# Altium schematic sheet 256Kx16_SRAM.SchDoc: 256Kx16 SRAM
size A4; Organization: Altium Limited.
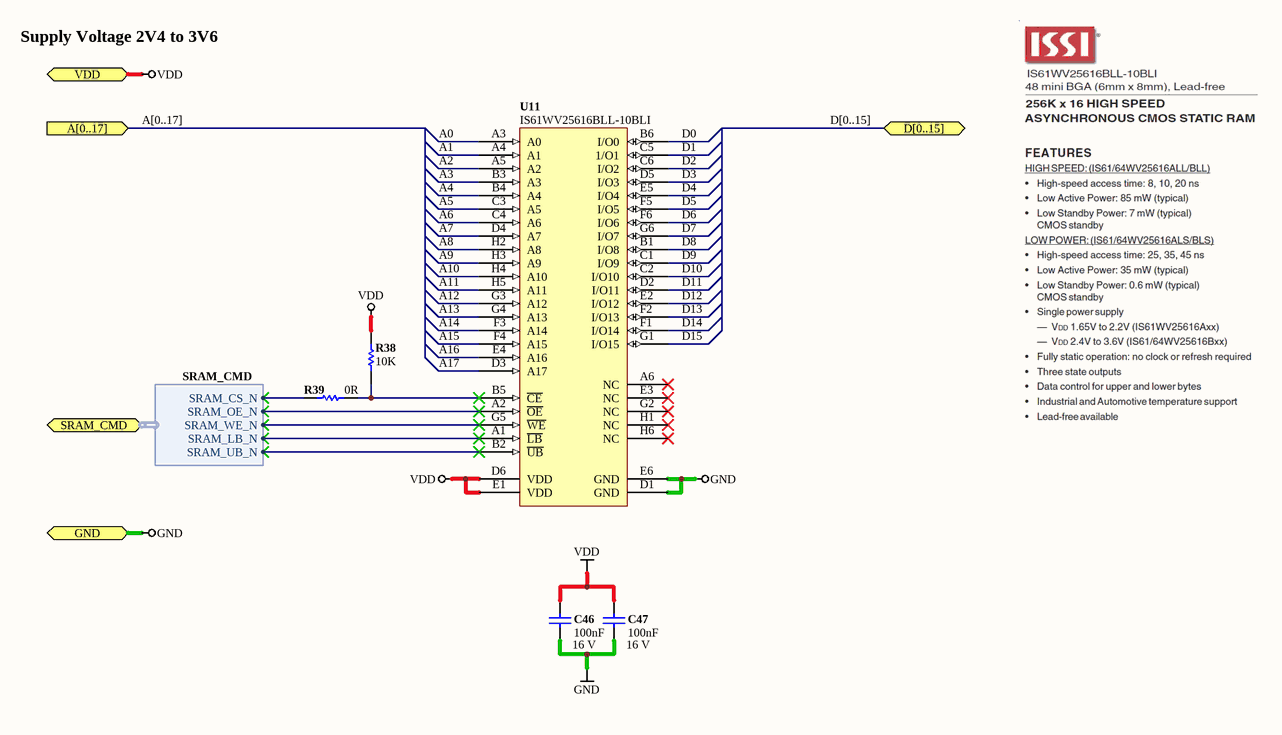
[diagram p0: 256Kx16_SRAM.SchDoc]

## Parts
C46  value 100nF  Rated Voltage: 16 V  [CAPC0402(1005)60_N]  (hidden comment: CAP 100nF 16V 0402(1005))
C47  value 100nF  Rated Voltage: 16 V  [CAPC0402(1005)60_N]  (hidden comment: CAP 100nF 16V 0402(1005))
R38  value 10K  [RESC0402(1005)_N]  (hidden comment: 10K 1% 0402(1005))
R39  value 0R  [RESC0402(1005)_N]  (hidden comment: Jumper 0402(1005))
U11  IS61WV25616BLL-10BLI  [ISSI-48L-TFBGA]

## Ports
A[0..17] (in), D[0..15] (bidir), GND, SRAM_CMD (harness SRAM_CMD), VDD

## Harnesses
SRAM_CMD: SRAM_OE_N, SRAM_WE_N, SRAM_LB_N, SRAM_UB_N, SRAM_CS_N

## Nets
GND: C46.1 C47.1 U11.D1(GND) U11.E6(GND) ; port GND
VDD: C46.2 C47.2 R38.2 U11.D6(VDD) U11.E1(VDD) ; port VDD
A0: U11.A3(A0)
A1: U11.A4(A1)
A2: U11.A5(A2)
A3: U11.B3(A3)
A4: U11.B4(A4)
A5: U11.C3(A5)
A6: U11.C4(A6)
A7: U11.D4(A7)
A8: U11.H2(A8)
A9: U11.H3(A9)
A10: U11.H4(A10)
A11: U11.H5(A11)
A12: U11.G3(A12)
A13: U11.G4(A13)
A14: U11.F3(A14)
A15: U11.F4(A15)
A16: U11.E4(A16)
A17: U11.D3(A17)
D0: U11.B6(I/O0)
D1: U11.C5(1/O1)
D2: U11.C6(I/O2)
D3: U11.D5(I/O3)
D4: U11.E5(I/O4)
D5: U11.F5(I/O5)
D6: U11.F6(I/O6)
D7: U11.G6(I/O7)
D8: U11.B1(I/O8)
D9: U11.C1(I/O9)
D10: U11.C2(I/O10)
D11: U11.D2(I/O11)
D12: U11.E2(I/O12)
D13: U11.F2(I/O13)
D14: U11.F1(I/O14)
D15: U11.G1(I/O15)
NetR38_1: R38.1 R39.2 U11.B5(~{CE})
NetR39_1: R39.1 ; port SRAM_CMD.SRAM_CS_N
NetU11_A1: U11.A1(~{LB}) ; port SRAM_CMD.SRAM_LB_N
NetU11_A2: U11.A2(~{OE}) ; port SRAM_CMD.SRAM_OE_N
NetU11_B2: U11.B2(~{UB}) ; port SRAM_CMD.SRAM_UB_N
NetU11_G5: U11.G5(~{WE}) ; port SRAM_CMD.SRAM_WE_N

Not connected (* = marked no-connect by the designer): U11 A6(NC)* E3(NC)* G2(NC)* H1(NC)* H6(NC)*

## Buses and harness runs
bus A[0..17] = port A[0..17]
bus D[0..15] = port D[0..15]

## Notes on the sheet
- Supply Voltage 2V4 to 3V6
- Sheet Title
- Project Title
- Size:
- Date:
- A4
- Item:
- Time:
- Revision:
- Sheet
- of
- File:

## Library data of the parts
C46 C47 = CMP-1034-02069-1: CAP 100nF 16V ±10% 0402 (1005 Metric) Thickness 0.6mm SMD; Case-EIA: 0402; Case-Metric: 1005; Max Thickness: 0.6 mm; Tolerance: ±10%; Technology: SMT
R38 = CMP-1011-00623-1: 10K 0.063W 1% 0402 (1005 Metric)  SMD; Case-Metric: 1005; Case-EIA: 0402; Tolerance: 1 %; Technology: SMT; Power: 0.063 W
R39 = CMP-1011-00001-1: Jumper 0402 (1005 Metric); Tolerance: 1%; Case-Metric: 1005; Power: None; Case-EIA: 0402; Technology: SMT
U11 = CMP-5069-00000-1: 256K x 16 High speed asynchronous CMOS Static RAM; Low active power: 85mW; Sub-class: SRAM; Voltage Range: 2.4V to 3.6V; Package: TFBGA; Class: RAM